# Altium project bailey.PrjPcb (part 10 of 11)
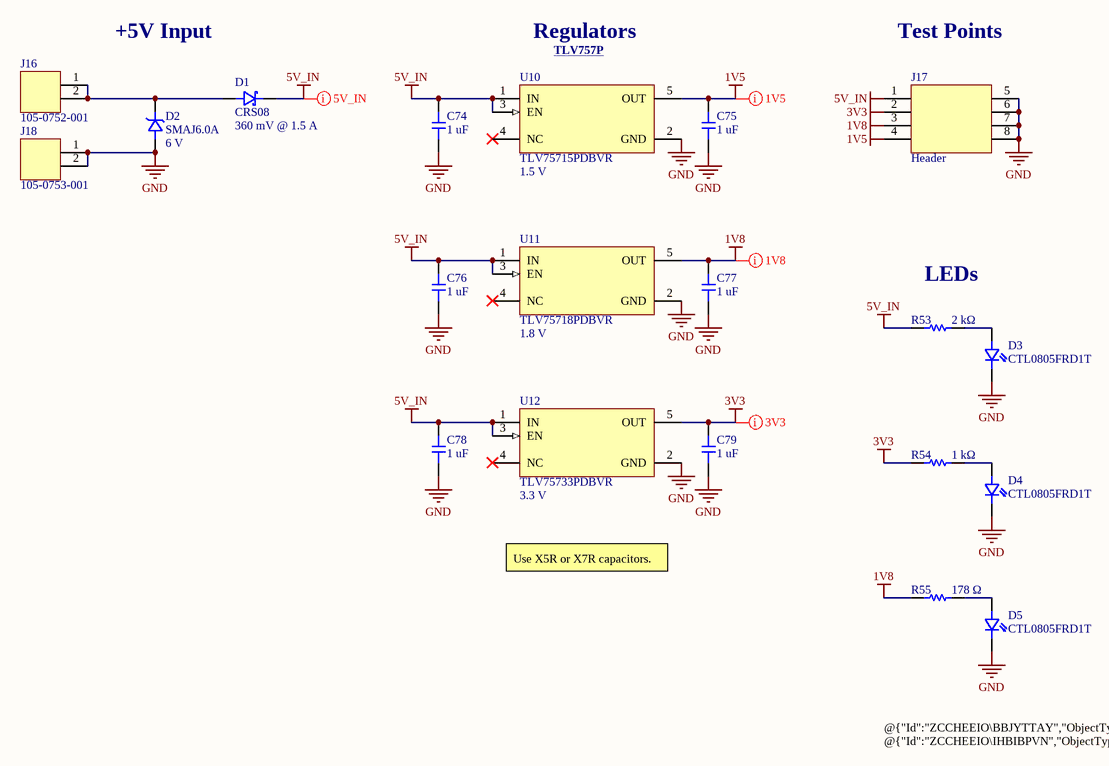
[diagram p14: POWER.SchDoc]

## Sheet POWER.SchDoc (continued)
### Library data of the parts
C74-C79 = CAP: 50V 1uF X7R ±10% 0805 Multilayer Ceramic Capacitors MLCC - SMD/SMT ROHS; Manufacturer: Samsung Electro-Mechanics; Manufacturer Part Number: CL21B105KBFNNNE; Value: 1µF; Tolerance: 10%; Voltage Rating: 50 V; Dielectric: Ceramic; Package Size: 0805; Supplier: DigiKey; Supplier Part Number: 1276-1029-1-ND; RoHS: Compliant; Category: Ceramic Capacitors; Stock: 1783591; Pricing: 1=0.08, 10=0.013 (USD); Case/Package: 0805; Case Code (Imperial): 0805; Case Code (Metric): 2012; China RoHS: Compliant; Country of Origin: Mainland China, Philippines, South Korea; Depth: 1.25mm; Dielectric Material: Ceramic; Export Control Classification Number (ECCN) Code: EAR99; Height: 1.35mm; Harmonized Tariff Schedule (HTS) Code: 8532.24.00.20; Introduction Date: 2010-07-30; Length: 2mm; Lifecycle Status: Production; Material: Ceramic; Max Operating Temperature: 125°C; Min Operating Temperature: -55°C; Mounting Technology: Surface Mount; Number of Terminals: 2; Radiation Hardening: No; REACH SVHC: Yes; Schedule B: 8532240020, 8532240020|8532240020, 8532240020|8532240020|8532240020, 8532240020|8532240020|8532240020|8532240020; Thickness: 1.3462mm; Voltage: 50V; Voltage Rating (DC): 50V; Width: 1.25mm; ComponentLink1URL: https://datasheet.octopart.com:443/CL21B105KBFNNNE-Samsung-Electro-Mechanics-datasheet-136482495.pdf?src-supplier=IHS; ComponentLink1Description: https://datasheet.octopart.com:443/CL21B105KBFNNNE-Samsung-Electro-Mechanics-datasheet-136482495.pdf?src-supplier=IHS; ComponentLink2URL: https://datasheet.octopart.com:443/CL21B105KBFNNNE-Samsung-Electro-Mechanics-datasheet-11733377.pdf?src-supplier=Future+Electronics; ComponentLink2Description: https://datasheet.octopart.com:443/CL21B105KBFNNNE-Samsung-Electro-Mechanics-datasheet-11733377.pdf?src-supplier=Future+Electronics; ComponentLink3URL: https://datasheet.octopart.com:443/CL21B105KBFNNNE-Samsung-Electro-Mechanics-datasheet-116891038.pdf?src-supplier=Future+Electronics; ComponentLink3Description: https://datasheet.octopart.com:443/CL21B105KBFNNNE-Samsung-Electro-Mechanics-datasheet-116891038.pdf?src-supplier=Future+Electronics; ComponentLink4URL: https://datasheet.octopart.com:443/CL21B105KBFNNNE-Samsung-Electro-Mechanics-datasheet-81462183.pdf?src-supplier=Future+Electronics; ComponentLink4Description: https://datasheet.octopart.com:443/CL21B105KBFNNNE-Samsung-Electro-Mechanics-datasheet-81462183.pdf?src-supplier=Future+Electronics; ComponentLink5URL: https://datasheet.octopart.com:443/CL21B105KBFNNNE-Samsung-datasheet-48647582.pdf?src-supplier=Future+Electronics; ComponentLink5Description: https://datasheet.octopart.com:443/CL21B105KBFNNNE-Samsung-datasheet-48647582.pdf?src-supplier=Future+Electronics; ComponentLink6URL: https://datasheet.octopart.com:443/CL21B105KBFNNNE-Samsung-datasheet-8326294.pdf?src-supplier=Future+Electronics; ComponentLink6Description: https://datasheet.octopart.com:443/CL21B105KBFNNNE-Samsung-datasheet-8326294.pdf?src-supplier=Future+Electronics; ComponentLink7URL: https://datasheet.octopart.com:443/CL21B105KBFNNNE-Samsung-Electro-Mechanics-datasheet-149045959.pdf?src-supplier=Future+Electronics; ComponentLink7Description: https://datasheet.octopart.com:443/CL21B105KBFNNNE-Samsung-Electro-Mechanics-datasheet-149045959.pdf?src-supplier=Future+Electronics; ComponentLink8URL: https://datasheet.octopart.com/CL21B105KBFNNNE-Samsung-Electro-Mechanics-datasheet-97040617.pdf; ComponentLink8Description: https://datasheet.octopart.com/CL21B105KBFNNNE-Samsung-Electro-Mechanics-datasheet-97040617.pdf; ComponentLink9URL: https://datasheet.octopart.com/CL21B105KBFNNNE-Samsung-Electro-Mechanics-datasheet-8324245.pdf; ComponentLink9Description: https://datasheet.octopart.com/CL21B105KBFNNNE-Samsung-Electro-Mechanics-datasheet-8324245.pdf; ComponentLink10URL: https://datasheet.octopart.com:443/CL21B105KBFNNNE-Samsung-datasheet-59220082.pdf?src-supplier=TME; ComponentLink10Description: https://datasheet.octopart.com:443/CL21B105KBFNNNE-Samsung-datasheet-59220082.pdf?src-supplier=TME
D1 = CRS08: Rectifier Diode, Schottky, 1 Phase, 1 Element, 1.5A, 30V V(RRM); Manufacturer: Toshiba Semiconductor and Storage; Manufacturer Part Number: CRS08(TE85L,Q,M); Reverse Leakage Current: 1 mA @ 30 V; Value: 90pF; Element Configuration: Single; Max Forward Surge Current (Ifsm): 30A; Max Junction Temperature (Tj): 125°C; Max Reverse Leakage Current: 1mA; Number of Elements: 1; Peak Reverse Current: 50µA; Reverse Voltage: 30 V; Current: 1.5 A; Supplier: DigiKey; Supplier Part Number: CRS08QMCT-ND; RoHS: Compliant; Category: Rectifier Diodes; Stock: 58545; Pricing: 1=0.61, 10=0.374, 100=0.2556, 500=0.19356, 1000=0.17356 (USD); Average Rectified Current: 1.5A; Contact Plating: Silver, Tin; Export Control Classification Number (ECCN) Code: EAR99; Forward Current: 1.5A; Height: 1.08mm; Harmonized Tariff Schedule (HTS) Code: 8541.10.00.80; Introduction Date: 2000-03-07; Lead Free: Lead Free; Lifecycle Status: Production; Max Operating Temperature: 125°C; Max Output current: 1.5A; Max Repetitive Reverse Voltage (Vrrm): 30V; Max Reverse Voltage (DC): 30V; Max Surge Current: 30A; Min Operating Temperature: -40°C; Mounting Technology: Surface Mount; Pins: 2; Packaging: Cut Tape (CT); Peak Non-Repetitive Surge Current: 30A; Radiation Hardening: No; REACH SVHC: No; Reverse Standoff Voltage: 30V; Schedule B: 8541100080, 8541100080|8541100080|8541100080|8541100080|8541100080; ComponentLink1URL: https://datasheet.octopart.com:443/CRS08%28TE85L%2CQ%2CM%29-Toshiba-datasheet-181389526.pdf?src-supplier=IHS; ComponentLink1Description: https://datasheet.octopart.com:443/CRS08%28TE85L%2CQ%2CM%29-Toshiba-datasheet-181389526.pdf?src-supplier=IHS; ComponentLink2URL: https://datasheet.octopart.com:443/CRS08%28TE85L%2CQ%2CM%29-Toshiba-datasheet-11891833.pdf?src-supplier=_legacy+Avnet; ComponentLink2Description: https://datasheet.octopart.com:443/CRS08%28TE85L%2CQ%2CM%29-Toshiba-datasheet-11891833.pdf?src-supplier=_legacy+Avnet; ComponentLink3URL: https://datasheet.octopart.com:443/CRS08%28TE85L%2CQ%2CM%29-Toshiba-datasheet-97785529.pdf?src-supplier=TME; ComponentLink3Description: https://datasheet.octopart.com:443/CRS08%28TE85L%2CQ%2CM%29-Toshiba-datasheet-97785529.pdf?src-supplier=TME; ComponentLink4URL: https://datasheet.octopart.com:443/CRS08%28TE85L%2CQ%2CM%29-Toshiba-datasheet-15948935.pdf?src-supplier=iiiC; ComponentLink4Description: https://datasheet.octopart.com:443/CRS08%28TE85L%2CQ%2CM%29-Toshiba-datasheet-15948935.pdf?src-supplier=iiiC
D2 = SMAJ6.0A: SMAJ Series 10.3 V 0.4 kW Surface Mount Uni-Directional TVS Diode - DO-214AC; Manufacturer: Littelfuse Inc.; Breakdown Voltage: 6.67 V; Maximum Clamping Voltage: 10.3 V; Clamping Voltage: 10.3V; Current: 41A; Direction: Unidirectional; Forward Voltage: 3.5V; Leakage Current: 1µA; Max Breakdown Voltage: 7.37V; Max Junction Temperature (Tj): 150°C; Max Power Dissipation: 3.3W; Max Reverse Leakage Current: 800µA; Max Surge Current: 38.8A; Min Breakdown Voltage: 6.67V; Number of Channels: 1; Operating Supply Voltage: 6V; Peak Pulse Power: 400W; Power Line Protection: No; Reverse Breakdown Voltage: 66.7V; Test Current: 10mA; Voltage: 60V; Manufacturer Part Number: SMAJ6.0A; Supplier: DigiKey; Supplier Part Number: SMAJ6.0ALFCT-ND; RoHS: Compliant; Category: TVS Diodes; Stock: 52074; Pricing: 1=0.16, 10=0.129, 100=0.098, 500=0.097, 1000=0.096, 2000=0.0955, 5000=0.075, 10000=0.06958, 15000=0.05923, 25000=0.05912 (USD); China RoHS: Non-Compliant; Composition: Zener; Country of Origin: Mainland China, Malaysia; Export Control Classification Number (ECCN) Code: EAR99; Height: 2.29mm; Harmonized Tariff Schedule (HTS) Code: 8541.10.00.50; Introduction Date: 2003-11-20; Lead Free: Lead Free; Length: 5.28mm; Lifecycle Status: Production; Max Operating Temperature: 150°C; Min Operating Temperature: -65°C; Mounting Technology: Surface Mount; Number of Elements: 1; Pins: 2; Number of Terminals: 2; Number of Unidirectional Channels: 1; Packaging: Cut Tape; Peak Pulse Current: 38.8A; Peak Reverse Current: 800µA; Polarity: Unidirectional; Power Dissipation: 400W; Power Rating: 400W; Radiation Hardening: No; REACH SVHC: No; Reverse Voltage: 6V; Schedule B: 8541100080, 8541100080|8541100080|8541100080|8541100080|8541100080; Termination: SMD/SMT; Voltage Rating (DC): 6V; Width: 2.79mm; ComponentLink1URL: https://datasheet.octopart.com:443/SMAJ6.0A-Littelfuse-datasheet-150463581.pdf?src-supplier=Newark; ComponentLink1Description: https://datasheet.octopart.com:443/SMAJ6.0A-Littelfuse-datasheet-150463581.pdf?src-supplier=Newark; ComponentLink2URL: https://datasheet.octopart.com:443/SMAJ6.0A-Littelfuse-datasheet-63710798.pdf?src-supplier=element14+APAC; ComponentLink2Description: https://datasheet.octopart.com:443/SMAJ6.0A-Littelfuse-datasheet-63710798.pdf?src-supplier=element14+APAC; ComponentLink3URL: https://datasheet.octopart.com:443/SMAJ6.0A-Littelfuse-datasheet-11547152.pdf?src-supplier=Farnell; ComponentLink3Description: https://datasheet.octopart.com:443/SMAJ6.0A-Littelfuse-datasheet-11547152.pdf?src-supplier=Farnell; ComponentLink4URL: https://datasheet.octopart.com:443/SMAJ6.0A-Littelfuse-datasheet-5393952.pdf?src-supplier=Farnell; ComponentLink4Description: https://datasheet.octopart.com:443/SMAJ6.0A-Littelfuse-datasheet-5393952.pdf?src-supplier=Farnell; ComponentLink5URL: https://datasheet.octopart.com:443/SMAJ6.0A-Littelfuse-datasheet-511791.pdf?src-supplier=Farnell; ComponentLink5Description: https://datasheet.octopart.com:443/SMAJ6.0A-Littelfuse-datasheet-511791.pdf?src-supplier=Farnell; ComponentLink6URL: https://datasheet.octopart.com:443/SMAJ6.0A-Littelfuse-datasheet-165289143.pdf?src-supplier=Electro+Sonic; ComponentLink6Description: https://datasheet.octopart.com:443/SMAJ6.0A-Littelfuse-datasheet-165289143.pdf?src-supplier=Electro+Sonic; ComponentLink7URL: https://datasheet.octopart.com:443/SMAJ6.0A-Littelfuse-datasheet-112042111.pdf?src-supplier=JRH+Electronics; ComponentLink7Description: https://datasheet.octopart.com:443/SMAJ6.0A-Littelfuse-datasheet-112042111.pdf?src-supplier=JRH+Electronics; ComponentLink8URL: https://datasheet.octopart.com:443/SMAJ6.0A-Littelfuse-datasheet-17901671.pdf?src-supplier=Future+Electronics; ComponentLink8Description: https://datasheet.octopart.com:443/SMAJ6.0A-Littelfuse-datasheet-17901671.pdf?src-supplier=Future+Electronics; ComponentLink9URL: https://datasheet.octopart.com:443/SMAJ6.0A-Littelfuse-datasheet-1053.pdf?src-supplier=DigiKey; ComponentLink9Description: https://datasheet.octopart.com:443/SMAJ6.0A-Littelfuse-datasheet-1053.pdf?src-supplier=DigiKey
D3-D5 = CTL0805FRD1T: Chip Type LED, 0805, Flat Lens, Red; Manufacturer: Venkel; Manufacturer Part Number: CTL0805FRD1T-CT; Forward Voltage: 1.5 V; Current: 20 mA; Package Size: 0805
J16 = 105-0752-001: Red Tip Jack Standard Horizontal Pcb Mount For Diameter .080 Plug; Manufacturer: Cinch Connectivity Solutions Johnson; Body Material: Nylon, Polyamide; Breakdown Voltage: 2.1kV; Current Rating: 5A; Gender: Female; Insulation: Mating End Insulated; Number of Contacts: 1; Voltage Rating: 1.5kV; Manufacturer Part Number: 105-0752-001; Supplier: DigiKey; Supplier Part Number: J109-ND; RoHS: Compliant; Category: Connectors; Stock: 9687; Pricing: 1=1.26, 10=1.067, 25=1.0004, 50=0.9526, 100=0.907, 250=0.85016, 500=0.80954, 1000=0.77089, 2500=0.72264 (USD); Color: Red; Contact Material: Silver; Contact Plating: Silver; Depth: 3.96mm; Export Control Classification Number (ECCN) Code: EAR99; Height: 5.4102mm; Housing Color: Red; Housing Material: Nylon; Insulation Material: Nylon; Lead Free: Lead Free; Length: 10.46mm; Lifecycle Status: Production; Max Current Rating: 5A; Max Operating Temperature: 75°C; Min Operating Temperature: -55°C; Mounting Technology: Horizontal, Through Hole, Vertical; Number of Ports: 1; Operating Supply Voltage: 2.1kV; Orientation: Right Angle; Packaging: Bulk; Radiation Hardening: No; REACH SVHC: Yes; Termination: Solder; Voltage Rating (DC): 2.1kV; ComponentLink1URL: https://datasheet.octopart.com:443/105-0752-001-Cinch-Connectors-datasheet-38159067.pdf?src-supplier=element14+APAC; ComponentLink1Description: https://datasheet.octopart.com:443/105-0752-001-Cinch-Connectors-datasheet-38159067.pdf?src-supplier=element14+APAC; ComponentLink2URL: https://datasheet.octopart.com:443/105-0752-001-Cinch-Connectors-datasheet-13703203.pdf?src-supplier=element14+APAC; ComponentLink2Description: https://datasheet.octopart.com:443/105-0752-001-Cinch-Connectors-datasheet-13703203.pdf?src-supplier=element14+APAC; ComponentLink3URL: https://datasheet.octopart.com:443/105-0752-001-Cinch-Connectivity-Solutions-datasheet-128870955.pdf?src-supplier=RS+(Formerly+Allied+Electronics); ComponentLink3Description: https://datasheet.octopart.com:443/105-0752-001-Cinch-Connectivity-Solutions-datasheet-128870955.pdf?src-supplier=RS+(Formerly+Allied+Electronics); ComponentLink4URL: https://datasheet.octopart.com:443/105-0752-001-Cinch-Connectors-datasheet-9995220.pdf?src-supplier=RS+(Formerly+Allied+Electronics); ComponentLink4Description: https://datasheet.octopart.com:443/105-0752-001-Cinch-Connectors-datasheet-9995220.pdf?src-supplier=RS+(Formerly+Allied+Electronics); ComponentLink5URL: https://datasheet.octopart.com:443/105-0752-001-Cinch-Connectivity-Solutions-datasheet-180501155.pdf?src-supplier=IHS; ComponentLink5Description: https://datasheet.octopart.com:443/105-0752-001-Cinch-Connectivity-Solutions-datasheet-180501155.pdf?src-supplier=IHS; ComponentLink6URL: https://datasheet.octopart.com:443/105-0752-001-Cinch-Connectivity-Solutions-datasheet-182240639.pdf?src-supplier=IHS; ComponentLink6Description: https://datasheet.octopart.com:443/105-0752-001-Cinch-Connectivity-Solutions-datasheet-182240639.pdf?src-supplier=IHS; ComponentLink7URL: https://datasheet.octopart.com:443/105-0752-001-Emerson-Network-Power-datasheet-90554.pdf?src-supplier=element14; ComponentLink7Description: https://datasheet.octopart.com:443/105-0752-001-Emerson-Network-Power-datasheet-90554.pdf?src-supplier=element14; ComponentLink8URL: https://datasheet.octopart.com:443/105-0752-001-Emerson-Network-Power-datasheet-10411735.pdf?src-supplier=Farnell; ComponentLink8Description: https://datasheet.octopart.com:443/105-0752-001-Emerson-Network-Power-datasheet-10411735.pdf?src-supplier=Farnell; ComponentLink9URL: https://datasheet.octopart.com:443/105-0752-001-Emerson-Network-Power-datasheet-8828422.pdf?src-supplier=Farnell; ComponentLink9Description: https://datasheet.octopart.com:443/105-0752-001-Emerson-Network-Power-datasheet-8828422.pdf?src-supplier=Farnell; ComponentLink10URL: https://datasheet.octopart.com:443/105-0752-001-Emerson-Network-Power-datasheet-10031126.pdf?src-supplier=Farnell; ComponentLink10Description: https://datasheet.octopart.com:443/105-0752-001-Emerson-Network-Power-datasheet-10031126.pdf?src-supplier=Farnell; ComponentLink11URL: https://datasheet.octopart.com:443/105-0752-001-Emerson-Network-Power-datasheet-47159.pdf?src-supplier=Farnell; ComponentLink11Description: https://datasheet.octopart.com:443/105-0752-001-Emerson-Network-Power-datasheet-47159.pdf?src-supplier=Farnell; ComponentLink12URL: https://datasheet.octopart.com:443/105-0752-001-Emerson-Network-Power-datasheet-40124.pdf?src-supplier=Farnell; ComponentLink12Description: https://datasheet.octopart.com:443/105-0752-001-Emerson-Network-Power-datasheet-40124.pdf?src-supplier=Farnell; ComponentLink13URL: https://datasheet.octopart.com:443/105-0752-001-Emerson-Network-Power-datasheet-29036.pdf?src-supplier=Farnell; ComponentLink13Description: https://datasheet.octopart.com:443/105-0752-001-Emerson-Network-Power-datasheet-29036.pdf?src-supplier=Farnell
J17 = CONN_2x4_2.54mm_PinHeader_Vertical: Pin Header, Board-to-Board, 2.54 mm, 2 Rows, 8 Contacts, Through Hole, TSW Series; Manufacturer: Samtec; Manufacturer Part Number: TSW-104-07-F-D; Manufacturer Lifecycle Status: PRODUCTION; Connector Type: Male Pin; Gender: Male; Max Current Rating: 7.6A; Max Voltage Rating (AC): 550V; Number of Contacts: 8; Pitch: 2.54mm; Supplier: DigiKey; Supplier Part Number: SAM8996-ND; RoHS: Compliant; Category: Headers and Wire Housings; Stock: 18480; Pricing: 1=0.43, 50=0.37, 100=0.31, 500=0.26, 1000=0.22, 2000=0.19, 5000=0.17, 10000=0.15 (USD); Color: Black; Contact Material: Bronze; Contact Mating Length: 5.842mm; Contact Plating: Gold; Depth: 5.08mm; Housing Color: Black; Housing Material: Polyester; Lead Pitch: 2.54mm; Length: 10.16mm; Lifecycle Status: Production; Max Operating Temperature: 125°C; Min Operating Temperature: -55°C; Mounting Technology: Through Hole; Number of Positions: 8; Number of Rows: 2; Orientation: Straight; Radiation Hardening: No; REACH SVHC: No; Row Spacing: 2.54mm; Termination: Solder; ComponentLink1URL: https://datasheet.octopart.com:443/TSW-104-07-F-D-Samtec-datasheet-97325576.pdf?src-supplier=Sager+Electronics; ComponentLink1Description: https://datasheet.octopart.com:443/TSW-104-07-F-D-Samtec-datasheet-97325576.pdf?src-supplier=Sager+Electronics; ComponentLink2URL: https://datasheet.octopart.com:443/TSW-104-07-F-D-Samtec-datasheet-151455181.pdf?src-supplier=Sager+Electronics; ComponentLink2Description: https://datasheet.octopart.com:443/TSW-104-07-F-D-Samtec-datasheet-151455181.pdf?src-supplier=Sager+Electronics; ComponentLink3URL: https://sigma.octopart.com:443/97325577/technical_drawing/Samtec-TSW-104-07-F-D.pdf?src-supplier=HQonline; ComponentLink3Description: https://sigma.octopart.com:443/97325577/technical_drawing/Samtec-TSW-104-07-F-D.pdf?src-supplier=HQonline; ComponentLink4URL: https://datasheet.octopart.com:443/TSW-104-07-F-D-Samtec-datasheet-136646178.pdf?src-supplier=Master+Electronics; ComponentLink4Description: https://datasheet.octopart.com:443/TSW-104-07-F-D-Samtec-datasheet-136646178.pdf?src-supplier=Master+Electronics; ComponentLink5URL: https://datasheet.octopart.com:443/TSW-104-07-F-D-Samtec-datasheet-182948906.pdf?src-supplier=JRH+Electronics; ComponentLink5Description: https://datasheet.octopart.com:443/TSW-104-07-F-D-Samtec-datasheet-182948906.pdf?src-supplier=JRH+Electronics; ComponentLink6URL: https://datasheet.octopart.com:443/TSW-104-07-F-D-Samtec-datasheet-160657603.pdf?src-supplier=Toby+Electronics; ComponentLink6Description: https://datasheet.octopart.com:443/TSW-104-07-F-D-Samtec-datasheet-160657603.pdf?src-supplier=Toby+Electronics; ComponentLink7URL: https://datasheet.octopart.com:443/TSW-104-07-F-D-Samtec-datasheet-116539033.pdf?src-supplier=Toby+Electronics; ComponentLink7Description: https://datasheet.octopart.com:443/TSW-104-07-F-D-Samtec-datasheet-116539033.pdf?src-supplier=Toby+Electronics; ComponentLink8URL: https://datasheet.octopart.com:443/TSW-104-07-F-D-Samtec-datasheet-116536310.pdf?src-supplier=Toby+Electronics; ComponentLink8Description: https://datasheet.octopart.com:443/TSW-104-07-F-D-Samtec-datasheet-116536310.pdf?src-supplier=Toby+Electronics; ComponentLink9URL: https://datasheet.octopart.com:443/TSW-104-07-F-D-Samtec-datasheet-116615235.pdf?src-supplier=Electro+Sonic; ComponentLink9Description: https://datasheet.octopart.com:443/TSW-104-07-F-D-Samtec-datasheet-116615235.pdf?src-supplier=Electro+Sonic; ComponentLink10URL: https://datasheet.octopart.com/TSW-104-07-F-D-Samtec-datasheet-86818365.pdf; ComponentLink10Description: https://datasheet.octopart.com/TSW-104-07-F-D-Samtec-datasheet-86818365.pdf; ComponentLink11URL: https://datasheet.octopart.com:443/TSW-104-07-F-D-Samtec-datasheet-62107121.pdf?src-supplier=Newark; ComponentLink11Description: https://datasheet.octopart.com:443/TSW-104-07-F-D-Samtec-datasheet-62107121.pdf?src-supplier=Newark; ComponentLink12URL: https://datasheet.octopart.com:443/TSW-104-07-F-D-Samtec-datasheet-11047283.pdf?src-supplier=Newark; ComponentLink12Description: https://datasheet.octopart.com:443/TSW-104-07-F-D-Samtec-datasheet-11047283.pdf?src-supplier=Newark
J18 = 105-0753-001: Test Jack, 2mm Diameter Standard Tip Plugs, 5 A, 1.32 mm, 1.5 kV, Black; Manufacturer: Cinch Connectivity Solutions Johnson; Body Material: Nylon, Polyamide; Breakdown Voltage: 2.1kV; Current Rating: 5A; Gender: Female; Insulation: Mating End Insulated; Number of Contacts: 1; Voltage Rating: 1.5kV; Manufacturer Part Number: 105-0753-001; Supplier: DigiKey; Supplier Part Number: J110-ND; RoHS: Compliant; Category: Connectors; Stock: 926; Pricing: 1=1.24, 10=1.057, 25=0.9912, 50=0.9436, 100=0.8985, 250=0.84216, 500=0.80196, 1000=0.76366, 2500=0.71586 (USD); Color: Black; Contact Material: Copper, Silver; Contact Plating: Silver; Country of Origin: USA; Depth: 3.96mm; Diameter: 2mm; Export Control Classification Number (ECCN) Code: EAR99; Height: 5.4102mm; Housing Color: Black; Housing Material: Nylon; Inside Diameter: 2mm; Insulation Material: Nylon; Introduction Date: 1995-01-01; Lead Free: Lead Free; Length: 10.46mm; Lifecycle Status: Production; Max Current Rating: 5A; Max Operating Temperature: 75°C; Min Operating Temperature: -55°C; Mounting Technology: Horizontal, Through Hole, Vertical; Number of Ports: 1; Operating Supply Voltage: 2.1kV; Orientation: Right Angle; Packaging: Bulk; Radiation Hardening: No; REACH SVHC: Yes; Termination: Solder; Voltage Rating (DC): 2.1kV; ComponentLink1URL: https://datasheet.octopart.com:443/105-0753-001-Cinch-Connectors-datasheet-38159068.pdf?src-supplier=element14+APAC; ComponentLink1Description: https://datasheet.octopart.com:443/105-0753-001-Cinch-Connectors-datasheet-38159068.pdf?src-supplier=element14+APAC; ComponentLink2URL: https://datasheet.octopart.com:443/105-0753-001-Cinch-Connectivity-Solutions-datasheet-128870957.pdf?src-supplier=RS+(Formerly+Allied+Electronics); ComponentLink2Description: https://datasheet.octopart.com:443/105-0753-001-Cinch-Connectivity-Solutions-datasheet-128870957.pdf?src-supplier=RS+(Formerly+Allied+Electronics); ComponentLink3URL: https://datasheet.octopart.com:443/105-0753-001-Cinch-Connectors-datasheet-9764224.pdf?src-supplier=RS+(Formerly+Allied+Electronics); ComponentLink3Description: https://datasheet.octopart.com:443/105-0753-001-Cinch-Connectors-datasheet-9764224.pdf?src-supplier=RS+(Formerly+Allied+Electronics); ComponentLink4URL: https://datasheet.octopart.com:443/105-0753-001-Cinch-Connectivity-Solutions-datasheet-180501155.pdf?src-supplier=IHS; ComponentLink4Description: https://datasheet.octopart.com:443/105-0753-001-Cinch-Connectivity-Solutions-datasheet-180501155.pdf?src-supplier=IHS; ComponentLink5URL: https://datasheet.octopart.com:443/105-0753-001-Cinch-Connectivity-Solutions-datasheet-182240639.pdf?src-supplier=IHS; ComponentLink5Description: https://datasheet.octopart.com:443/105-0753-001-Cinch-Connectivity-Solutions-datasheet-182240639.pdf?src-supplier=IHS; ComponentLink6URL: https://datasheet.octopart.com:443/105-0753-001-Cinch-Connectors-datasheet-46969.pdf?src-supplier=Farnell; ComponentLink6Description: https://datasheet.octopart.com:443/105-0753-001-Cinch-Connectors-datasheet-46969.pdf?src-supplier=Farnell; ComponentLink7URL: https://datasheet.octopart.com:443/105-0753-001-Cinch-Connectors-datasheet-13702459.pdf?src-supplier=_legacy+Avnet; ComponentLink7Description: https://datasheet.octopart.com:443/105-0753-001-Cinch-Connectors-datasheet-13702459.pdf?src-supplier=_legacy+Avnet
R53 = RES: 100Mw Thick Film Resistors 100Ppm/ 1% 2K 0603 Chip Resistor Surface Mount Rohs; Manufacturer: Yageo; Manufacturer Part Number: RC0603FR-072KL; Value: 2kΩ; Temperature Coefficient: 100ppm/°C; Voltage Rating: 75V; Voltage Rating (DC): 50V; Tolerance: 1%; Power Rating: *; Package Size: 0603; Supplier: DigiKey; Supplier Part Number: 311-2.00KHRCT-ND; RoHS: Compliant; Category: Chip SMD Resistors; Stock: 1454971; Pricing: 1=0.1, 10=0.007, 25=0.0068, 50=0.0056 (USD); Case/Package: 0603; Case Code (Imperial): 0603; China RoHS: Non-Compliant; Composition: Thick Film; Country of Origin: Mainland China, Taiwan; Depth: 800µm; Export Control Classification Number (ECCN) Code: EAR99; Features: Moisture Resistant; Height: 450µm; Harmonized Tariff Schedule (HTS) Code: 8533.21.00.30; Introduction Date: 2004-10-04; Lead Free: Lead Free; Length: 1.6mm; Lifecycle Status: Production; Max Operating Temperature: 155°C; Max Power Dissipation: 100mW; Military Standard: Not; Min Operating Temperature: -55°C; Mounting Technology: Surface Mount; Pins: 2; Number of Terminals: 2; Number of Terminations: 2; Packaging: Tape & Reel; Power Dissipation: 100mW; REACH SVHC: Yes; Schedule B: 8533210045, 8533210045|8533210045, 8533210045|8533210045|8533210045, 8533210045|8533210045|8533210045|8533210045; Termination: SMD/SMT; Width: 800µm; Working Voltage: 75V; ComponentLink1URL: https://datasheet.octopart.com:443/RC0603FR-072KL-Yageo-datasheet-175887523.pdf?src-supplier=Newark; ComponentLink1Description: https://datasheet.octopart.com:443/RC0603FR-072KL-Yageo-datasheet-175887523.pdf?src-supplier=Newark; ComponentLink2URL: https://datasheet.octopart.com:443/RC0603FR-072KL-Yageo-datasheet-103092701.pdf?src-supplier=Upverter; ComponentLink2Description: https://datasheet.octopart.com:443/RC0603FR-072KL-Yageo-datasheet-103092701.pdf?src-supplier=Upverter; ComponentLink3URL: https://datasheet.octopart.com:443/RC0603FR-072KL-Yageo-datasheet-8328172.pdf?src-supplier=element14+APAC; ComponentLink3Description: https://datasheet.octopart.com:443/RC0603FR-072KL-Yageo-datasheet-8328172.pdf?src-supplier=element14+APAC; ComponentLink4URL: https://datasheet.octopart.com:443/RC0603FR-072KL-Yageo-datasheet-34211833.pdf?src-supplier=element14+APAC; ComponentLink4Description: https://datasheet.octopart.com:443/RC0603FR-072KL-Yageo-datasheet-34211833.pdf?src-supplier=element14+APAC; ComponentLink5URL: https://datasheet.octopart.com:443/RC0603FR-072KL-Yageo-datasheet-62067350.pdf?src-supplier=Farnell; ComponentLink5Description: https://datasheet.octopart.com:443/RC0603FR-072KL-Yageo-datasheet-62067350.pdf?src-supplier=Farnell; ComponentLink6URL: https://datasheet.octopart.com:443/RC0603FR-072KL-Yageo-Group-datasheet-176638170.pdf?src-supplier=Future+Electronics; ComponentLink6Description: https://datasheet.octopart.com:443/RC0603FR-072KL-Yageo-Group-datasheet-176638170.pdf?src-supplier=Future+Electronics; ComponentLink7URL: https://datasheet.octopart.com:443/RC0603FR-072KL-Yageo-datasheet-164759695.pdf?src-supplier=Future+Electronics; ComponentLink7Description: https://datasheet.octopart.com:443/RC0603FR-072KL-Yageo-datasheet-164759695.pdf?src-supplier=Future+Electronics; ComponentLink8URL: https://datasheet.octopart.com:443/RC0603FR-072KL-Yageo-datasheet-137700087.pdf?src-supplier=Future+Electronics; ComponentLink8Description: https://datasheet.octopart.com:443/RC0603FR-072KL-Yageo-datasheet-137700087.pdf?src-supplier=Future+Electronics; ComponentLink9URL: https://datasheet.octopart.com:443/RC0603FR-072KL-Yageo-datasheet-27584510.pdf?src-supplier=Future+Electronics; ComponentLink9Description: https://datasheet.octopart.com:443/RC0603FR-072KL-Yageo-datasheet-27584510.pdf?src-supplier=Future+Electronics; ComponentLink10URL: https://datasheet.octopart.com:443/RC0603FR-072KL-Yageo-datasheet-15599030.pdf?src-supplier=Future+Electronics; ComponentLink10Description: https://datasheet.octopart.com:443/RC0603FR-072KL-Yageo-datasheet-15599030.pdf?src-supplier=Future+Electronics; ComponentLink11URL: https://datasheet.octopart.com:443/RC0603FR-072KL-Yageo-datasheet-12596169.pdf?src-supplier=Future+Electronics; ComponentLink11Description: https://datasheet.octopart.com:443/RC0603FR-072KL-Yageo-datasheet-12596169.pdf?src-supplier=Future+Electronics; ComponentLink12URL: https://datasheet.octopart.com:443/RC0603FR-072KL-Yageo-datasheet-8324193.pdf?src-supplier=Future+Electronics; ComponentLink12Description: https://datasheet.octopart.com:443/RC0603FR-072KL-Yageo-datasheet-8324193.pdf?src-supplier=Future+Electronics; ComponentLink13URL: https://datasheet.octopart.com/RC0603FR-072KL-Yageo-datasheet-73766026.pdf; ComponentLink13Description: https://datasheet.octopart.com/RC0603FR-072KL-Yageo-datasheet-73766026.pdf; ComponentLink14URL: https://datasheet.octopart.com:443/RC0603FR-072KL-Yageo-datasheet-118562.pdf?src-supplier=DigiKey; ComponentLink14Description: https://datasheet.octopart.com:443/RC0603FR-072KL-Yageo-datasheet-118562.pdf?src-supplier=DigiKey; ComponentLink15URL: https://datasheet.octopart.com:443/RC0603FR-072KL-Yageo-datasheet-14181487.pdf?src-supplier=iiiC; ComponentLink15Description: https://datasheet.octopart.com:443/RC0603FR-072KL-Yageo-datasheet-14181487.pdf?src-supplier=iiiC; ComponentLink16URL: http://sigma.octopart.com:80/conflict_mineral_statement/Yageo-company-3.pdf?src-supplier=Compliance+Statements; ComponentLink16Description: http://sigma.octopart.com:80/conflict_mineral_statement/Yageo-company-3.pdf?src-supplier=Compliance+Statements; ComponentLink17URL: http://sigma.octopart.com:80/rohs_statement/Yageo-company-2.pdf?src-supplier=Compliance+Statements; ComponentLink17Description: http://sigma.octopart.com:80/rohs_statement/Yageo-company-2.pdf?src-supplier=Compliance+Statements
R54 = RES: 100mW Thick Film Resistors 75V ±100ppm/℃ ±1% 1kΩ 0603 Chip Resistor - Surface Mount ROHS; Manufacturer: Yageo; Manufacturer Part Number: RC0603FR-071KL; Temperature Coefficient: 100ppm/°C; Voltage Rating: 50V; Tolerance: 1%; Power Rating: *; Package Size: 0603; Supplier: DigiKey; Supplier Part Number: 311-1.00KHRCT-ND; RoHS: Compliant; Category: Chip SMD Resistors; Stock: 5944272; Pricing: 1=0.1, 10=0.008, 25=0.0076, 50=0.0072, 100=0.0061, 250=0.00568, 1000=0.00569, 5000=0.00204 (USD); Case/Package: 0603; Case Code (Imperial): 0603; Case Code (Metric): 0603; China RoHS: Non-Compliant; Composition: Thick Film; Contact Plating: Tin; Country of Origin: Mainland China, Taiwan; Depth: 800µm; Export Control Classification Number (ECCN) Code: EAR99; Height: 450µm; Harmonized Tariff Schedule (HTS) Code: 8533.21.00.30; Introduction Date: 2004-10-04; Lead Free: Lead Free; Length: 1.6mm; Lifecycle Status: Production; Max Operating Temperature: 155°C; Military Standard: Not; Min Operating Temperature: -55°C; Mounting Technology: Surface Mount; Pins: 2; Number of Terminals: 2; Packaging: Tape and Reel; Power Dissipation: 100mW; Radiation Hardening: No; REACH SVHC: Yes; Value: 1kΩ; Schedule B: 8533210045, 8533210045|8533210045|8533210045|8533210045|8533210045|8533210045|8533210045|8533210045|8533210045|8533210045|8533210045|8533210045|8533210045|8533210045|8533210045|8533210045|8533210045|8533210045|8533210045|8533210045|8533210045|8533210045|8533210045|85; Termination: SMD/SMT; Voltage Rating (DC): 50V; Width: 800µm; Working Voltage: 75V; ComponentLink1URL: https://datasheet.octopart.com:443/RC0603FR-071KL-Yageo-datasheet-175887523.pdf?src-supplier=Newark; ComponentLink1Description: https://datasheet.octopart.com:443/RC0603FR-071KL-Yageo-datasheet-175887523.pdf?src-supplier=Newark; ComponentLink2URL: https://datasheet.octopart.com:443/RC0603FR-071KL-Yageo-datasheet-34211833.pdf?src-supplier=Newark; ComponentLink2Description: https://datasheet.octopart.com:443/RC0603FR-071KL-Yageo-datasheet-34211833.pdf?src-supplier=Newark; ComponentLink3URL: https://datasheet.octopart.com:443/RC0603FR-071KL-Yageo-datasheet-12596169.pdf?src-supplier=Newark; ComponentLink3Description: https://datasheet.octopart.com:443/RC0603FR-071KL-Yageo-datasheet-12596169.pdf?src-supplier=Newark; ComponentLink4URL: https://datasheet.octopart.com:443/RC0603FR-071KL-Yageo-datasheet-499455.pdf?src-supplier=Newark; ComponentLink4Description: https://datasheet.octopart.com:443/RC0603FR-071KL-Yageo-datasheet-499455.pdf?src-supplier=Newark; ComponentLink5URL: https://datasheet.octopart.com:443/RC0603FR-071KL-Yageo-datasheet-503470.pdf?src-supplier=Newark; ComponentLink5Description: https://datasheet.octopart.com:443/RC0603FR-071KL-Yageo-datasheet-503470.pdf?src-supplier=Newark; ComponentLink6URL: https://datasheet.octopart.com:443/RC0603FR-071KL-Yageo-datasheet-62067350.pdf?src-supplier=element14+APAC; ComponentLink6Description: https://datasheet.octopart.com:443/RC0603FR-071KL-Yageo-datasheet-62067350.pdf?src-supplier=element14+APAC; ComponentLink7URL: https://datasheet.octopart.com:443/RC0603FR-071KL-Yageo-datasheet-21426514.pdf?src-supplier=element14+APAC; ComponentLink7Description: https://datasheet.octopart.com:443/RC0603FR-071KL-Yageo-datasheet-21426514.pdf?src-supplier=element14+APAC; ComponentLink8URL: https://datasheet.octopart.com:443/RC0603FR-071KL-Yageo-datasheet-141265859.pdf?src-supplier=Upverter; ComponentLink8Description: https://datasheet.octopart.com:443/RC0603FR-071KL-Yageo-datasheet-141265859.pdf?src-supplier=Upverter; ComponentLink9URL: https://datasheet.octopart.com:443/RC0603FR-071KL-Yageo-datasheet-103092701.pdf?src-supplier=Upverter; ComponentLink9Description: https://datasheet.octopart.com:443/RC0603FR-071KL-Yageo-datasheet-103092701.pdf?src-supplier=Upverter; ComponentLink10URL: https://sigma.octopart.com:443/138820526/technical_drawing/Yageo-RC0603FR-071KL.pdf?src-supplier=Upverter; ComponentLink10Description: https://sigma.octopart.com:443/138820526/technical_drawing/Yageo-RC0603FR-071KL.pdf?src-supplier=Upverter; ComponentLink11URL: https://datasheet.octopart.com:443/RC0603FR-071KL-Yageo-datasheet-68297981.pdf?src-supplier=Upverter; ComponentLink11Description: https://datasheet.octopart.com:443/RC0603FR-071KL-Yageo-datasheet-68297981.pdf?src-supplier=Upverter; ComponentLink12URL: https://datasheet.octopart.com:443/RC0603FR-071KL-Yageo-datasheet-8328172.pdf?src-supplier=Farnell; ComponentLink12Description: https://datasheet.octopart.com:443/RC0603FR-071KL-Yageo-datasheet-8328172.pdf?src-supplier=Farnell; ComponentLink13URL: https://datasheet.octopart.com:443/RC0603FR-071KL-Yageo-datasheet-13691069.pdf?src-supplier=Farnell; ComponentLink13Description: https://datasheet.octopart.com:443/RC0603FR-071KL-Yageo-datasheet-13691069.pdf?src-supplier=Farnell; ComponentLink14URL: https://datasheet.octopart.com:443/RC0603FR-071KL-Yageo-datasheet-15599030.pdf?src-supplier=Seeed+Studio; ComponentLink14Description: https://datasheet.octopart.com:443/RC0603FR-071KL-Yageo-datasheet-15599030.pdf?src-supplier=Seeed+Studio; ComponentLink15URL: https://datasheet.octopart.com:443/RC0603FR-071KL-Yageo-Group-datasheet-176638170.pdf?src-supplier=Future+Electronics; ComponentLink15Description: https://datasheet.octopart.com:443/RC0603FR-071KL-Yageo-Group-datasheet-176638170.pdf?src-supplier=Future+Electronics; ComponentLink16URL: https://datasheet.octopart.com:443/RC0603FR-071KL-Yageo-datasheet-164759695.pdf?src-supplier=Future+Electronics; ComponentLink16Description: https://datasheet.octopart.com:443/RC0603FR-071KL-Yageo-datasheet-164759695.pdf?src-supplier=Future+Electronics; ComponentLink17URL: https://datasheet.octopart.com:443/RC0603FR-071KL-Yageo-datasheet-137700087.pdf?src-supplier=Future+Electronics; ComponentLink17Description: https://datasheet.octopart.com:443/RC0603FR-071KL-Yageo-datasheet-137700087.pdf?src-supplier=Future+Electronics; ComponentLink18URL: https://datasheet.octopart.com:443/RC0603FR071KL-Yageo-datasheet-27584510.pdf?src-supplier=Future+Electronics; ComponentLink18Description: https://datasheet.octopart.com:443/RC0603FR071KL-Yageo-datasheet-27584510.pdf?src-supplier=Future+Electronics; ComponentLink19URL: https://datasheet.octopart.com:443/RC0603FR-071KL-Yageo-datasheet-8324193.pdf?src-supplier=Future+Electronics; ComponentLink19Description: https://datasheet.octopart.com:443/RC0603FR-071KL-Yageo-datasheet-8324193.pdf?src-supplier=Future+Electronics; ComponentLink20URL: https://datasheet.octopart.com:443/RC0603FR-071KL-Yageo-datasheet-79472498.pdf?src-supplier=Megastar; ComponentLink20Description: https://datasheet.octopart.com:443/RC0603FR-071KL-Yageo-datasheet-79472498.pdf?src-supplier=Megastar; ComponentLink21URL: https://datasheet.octopart.com/RC0603FR-071KL-Yageo-datasheet-73766026.pdf; ComponentLink21Description: https://datasheet.octopart.com/RC0603FR-071KL-Yageo-datasheet-73766026.pdf; ComponentLink22URL: https://datasheet.octopart.com:443/RC0603FR-071KL-Yageo-datasheet-118562.pdf?src-supplier=DigiKey; ComponentLink22Description: https://datasheet.octopart.com:443/RC0603FR-071KL-Yageo-datasheet-118562.pdf?src-supplier=DigiKey; ComponentLink23URL: http://sigma.octopart.com:80/conflict_mineral_statement/Yageo-company-3.pdf?src-supplier=Compliance+Statements; ComponentLink23Description: http://sigma.octopart.com:80/conflict_mineral_statement/Yageo-company-3.pdf?src-supplier=Compliance+Statements; ComponentLink24URL: http://sigma.octopart.com:80/rohs_statement/Yageo-company-2.pdf?src-supplier=Compliance+Statements; ComponentLink24Description: http://sigma.octopart.com:80/rohs_statement/Yageo-company-2.pdf?src-supplier=Compliance+Statements
R55 = RES: Res Thick Film 0603 178 Ohm 1% 0.1W(1/10W) ±100ppm/C Pad SMD T/R; Manufacturer: Yageo; Manufacturer Part Number: RC0603FR-07178RL; Power Dissipation: 100mW; Value: 178Ω; Temperature Coefficient: 100ppm/°C; Voltage Rating: 75V; Voltage Rating (DC): 50V; Tolerance: 1%; Power Rating: *; Package Size: 0603; Supplier: DigiKey; Supplier Part Number: 311-178HRCT-ND; RoHS: Compliant; Category: Chip SMD Resistors; Stock: 269039; Pricing: 1=0.1, 10=0.006, 25=0.0056, 50=0.0052 (USD); Case/Package: 0603; Case Code (Imperial): 0603; China RoHS: Non-Compliant; Composition: Thick Film; Depth: 800µm; Height: 450µm; Lead Free: Lead Free; Length: 1.6mm; Lifecycle Status: Production; Max Operating Temperature: 155°C; Military Standard: Not; Min Operating Temperature: -55°C; Mounting Technology: Surface Mount; Number of Terminals: 2; Packaging: Tape & Reel; REACH SVHC: Yes; Schedule B: 8533210045, 8533210045|8533210045|8533210045|8533210045|8533210045; Termination: SMD/SMT; Width: 800µm; Working Voltage: 75V; ComponentLink1URL: https://datasheet.octopart.com:443/RC0603FR-07178RL-Yageo-datasheet-175887523.pdf?src-supplier=Newark; ComponentLink1Description: https://datasheet.octopart.com:443/RC0603FR-07178RL-Yageo-datasheet-175887523.pdf?src-supplier=Newark; ComponentLink2URL: https://datasheet.octopart.com:443/RC0603FR-07178RL-Yageo-datasheet-103092701.pdf?src-supplier=Upverter; ComponentLink2Description: https://datasheet.octopart.com:443/RC0603FR-07178RL-Yageo-datasheet-103092701.pdf?src-supplier=Upverter; ComponentLink3URL: https://datasheet.octopart.com:443/RC0603FR-07178RL-Yageo-Group-datasheet-176638170.pdf?src-supplier=Future+Electronics; ComponentLink3Description: https://datasheet.octopart.com:443/RC0603FR-07178RL-Yageo-Group-datasheet-176638170.pdf?src-supplier=Future+Electronics; ComponentLink4URL: https://datasheet.octopart.com:443/RC0603FR-07178RL-Yageo-datasheet-164759695.pdf?src-supplier=Future+Electronics; ComponentLink4Description: https://datasheet.octopart.com:443/RC0603FR-07178RL-Yageo-datasheet-164759695.pdf?src-supplier=Future+Electronics; ComponentLink5URL: https://datasheet.octopart.com:443/RC0603FR-07178RL-Yageo-datasheet-137700087.pdf?src-supplier=Future+Electronics; ComponentLink5Description: https://datasheet.octopart.com:443/RC0603FR-07178RL-Yageo-datasheet-137700087.pdf?src-supplier=Future+Electronics; ComponentLink6URL: https://datasheet.octopart.com:443/RC0603FR-07178RL-Yageo-datasheet-101672632.pdf?src-supplier=Future+Electronics; ComponentLink6Description: https://datasheet.octopart.com:443/RC0603FR-07178RL-Yageo-datasheet-101672632.pdf?src-supplier=Future+Electronics; ComponentLink7URL: https://datasheet.octopart.com:443/RC0603FR-07178RL-Yageo-datasheet-15599030.pdf?src-supplier=Future+Electronics; ComponentLink7Description: https://datasheet.octopart.com:443/RC0603FR-07178RL-Yageo-datasheet-15599030.pdf?src-supplier=Future+Electronics; ComponentLink8URL: https://datasheet.octopart.com:443/RC0603FR-07178RL-Yageo-datasheet-12596169.pdf?src-supplier=Future+Electronics; ComponentLink8Description: https://datasheet.octopart.com:443/RC0603FR-07178RL-Yageo-datasheet-12596169.pdf?src-supplier=Future+Electronics; ComponentLink9URL: https://datasheet.octopart.com:443/RC0603FR-07178RL-Yageo-datasheet-8328172.pdf?src-supplier=Future+Electronics; ComponentLink9Description: https://datasheet.octopart.com:443/RC0603FR-07178RL-Yageo-datasheet-8328172.pdf?src-supplier=Future+Electronics; ComponentLink10URL: https://datasheet.octopart.com:443/RC0603FR-07178RL-Yageo-datasheet-148775077.pdf?src-supplier=TME; ComponentLink10Description: https://datasheet.octopart.com:443/RC0603FR-07178RL-Yageo-datasheet-148775077.pdf?src-supplier=TME; ComponentLink11URL: https://datasheet.octopart.com/RC0603FR-07178RL-Yageo-datasheet-73766026.pdf; ComponentLink11Description: https://datasheet.octopart.com/RC0603FR-07178RL-Yageo-datasheet-73766026.pdf; ComponentLink12URL: https://datasheet.octopart.com:443/RC0603FR-07178RL-Yageo-datasheet-118562.pdf?src-supplier=DigiKey; ComponentLink12Description: https://datasheet.octopart.com:443/RC0603FR-07178RL-Yageo-datasheet-118562.pdf?src-supplier=DigiKey; ComponentLink13URL: http://sigma.octopart.com:80/conflict_mineral_statement/Yageo-company-3.pdf?src-supplier=Compliance+Statements; ComponentLink13Description: http://sigma.octopart.com:80/conflict_mineral_statement/Yageo-company-3.pdf?src-supplier=Compliance+Statements; ComponentLink14URL: http://sigma.octopart.com:80/rohs_statement/Yageo-company-2.pdf?src-supplier=Compliance+Statements; ComponentLink14Description: http://sigma.octopart.com:80/rohs_statement/Yageo-company-2.pdf?src-supplier=Compliance+Statements
U10 = TLV75715PDBVR: 1-A, low-IQ high-accuracy low-dropout (LDO) voltage regulator with enable 5-SOT-23 -40 to 125; Manufacturer: Texas Instruments; Manufacturer Lifecycle Status: ACTIVE; Output Current: 1 A; Number of Channels: 1; Manufacturer Part Number: TLV75715PDBVR; Supplier: DigiKey; Supplier Part Number: 296-51811-1-ND; RoHS: Compliant; Category: LDO Voltage Regulators; Stock: 5294; Pricing: 1=0.33, 10=0.229, 25=0.2032, 100=0.1751, 250=0.16168, 500=0.15358, 1000=0.14692 (USD); Case/Package: SOT-23; Height: 1.45mm; Length: 2.9mm; Lifecycle Status: Production; Pins: 5; Schedule B: 8542390000, 8542390000|8542390000|8542390000|8542390000|8542390000; Thickness: 1.2mm; Width: 1.6mm; ComponentLink1URL: https://sigma.octopart.com:443/177332311/technical_drawing/Texas-Instruments-TLV75715PDBVR.pdf?src-supplier=Texas+Instruments; ComponentLink1Description: https://sigma.octopart.com:443/177332311/technical_drawing/Texas-Instruments-TLV75715PDBVR.pdf?src-supplier=Texas+Instruments; ComponentLink2URL: https://octopart.com:443/opatz8j6/c1?t=d7hvVLm4alBnrD3gkoHfRsgVc1UpAt6tbgzimL6eSJHfNPIcKrEVXQLPrKOO7wEDCX4HSMm6lfhF85OQD0xZdGvf6YWAiJrNuU8QSKvAnaGmkYyNKOgtKPgJdm2OaEBsByZGVv6T58nARThbWe1wCDIr6BKAyHSOruR31SjFlLsIzO3eYwhk2SNazcjQEifyacoOczK47_MXfEqqNpMaSiFFoskCbrfDKYLBx_wVUhWKdX9fsUXPW-zYIgEWS08DbpwwKwl3pwwBgOyAlAA6_Yry7nSOOwYgpeH3zDS82lMdNd1MWU3-D1w86_UIiW06pjzBAlAruU2xcUUpgVxcbRgleA5mpoOQkUHtNLHgmtjr9P-5BMHIlnvvtbjHE33fVSndxig&src-supplier=Texas+Instruments; ComponentLink2Description: https://octopart.com:443/opatz8j6/c1?t=d7hvVLm4alBnrD3gkoHfRsgVc1UpAt6tbgzimL6eSJHfNPIcKrEVXQLPrKOO7wEDCX4HSMm6lfhF85OQD0xZdGvf6YWAiJrNuU8QSKvAnaGmkYyNKOgtKPgJdm2OaEBsByZGVv6T58nARThbWe1wCDIr6BKAyHSOruR31SjFlLsIzO3eYwhk2SNazcjQEifyacoOczK47_MXfEqqNpMaSiFFoskCbrfDKYLBx_wVUhWKdX9fsUXPW-zYIgEWS08DbpwwKwl3pwwBgOyAlAA6_Yry7nSOOwYgpeH3zDS82lMdNd1MWU3-D1w86_UIiW06pjzBAlAruU2xcUUpgVxcbRgleA5mpoOQkUHtNLHgmtjr9P-5BMHIlnvvtbjHE33fVSndxig&src-supplier=Texas+Instruments; ComponentLink3URL: https://sigma.octopart.com:443/175570406/technical_drawing/Texas-Instruments-TLV75715PDBVR.pdf?src-supplier=Texas+Instruments; ComponentLink3Description: https://sigma.octopart.com:443/175570406/technical_drawing/Texas-Instruments-TLV75715PDBVR.pdf?src-supplier=Texas+Instruments; ComponentLink4URL: https://sigma.octopart.com:443/169406034/technical_drawing/Texas-Instruments-TLV75715PDBVR.pdf?src-supplier=Texas+Instruments; ComponentLink4Description: https://sigma.octopart.com:443/169406034/technical_drawing/Texas-Instruments-TLV75715PDBVR.pdf?src-supplier=Texas+Instruments; ComponentLink5URL: https://sigma.octopart.com:443/155939316/technical_drawing/Texas-Instruments-TLV75715PDBVR.pdf?src-supplier=Texas+Instruments; ComponentLink5Description: https://sigma.octopart.com:443/155939316/technical_drawing/Texas-Instruments-TLV75715PDBVR.pdf?src-supplier=Texas+Instruments; ComponentLink6URL: https://sigma.octopart.com:443/102331370/technical_drawing/Texas-Instruments-TLV75715PDBVR.pdf?src-supplier=Texas+Instruments; ComponentLink6Description: https://sigma.octopart.com:443/102331370/technical_drawing/Texas-Instruments-TLV75715PDBVR.pdf?src-supplier=Texas+Instruments; ComponentLink7URL: https://datasheet.octopart.com:443/TLV75715PDBVR-Texas-Instruments-datasheet-164419132.pdf?src-supplier=Augswan; ComponentLink7Description: https://datasheet.octopart.com:443/TLV75715PDBVR-Texas-Instruments-datasheet-164419132.pdf?src-supplier=Augswan; ComponentLink8URL: http://sigma.octopart.com:80/reach_statement/Texas-Instruments-company-64.pdf?src-supplier=Compliance+Statements; ComponentLink8Description: http://sigma.octopart.com:80/reach_statement/Texas-Instruments-company-64.pdf?src-supplier=Compliance+Statements; ComponentLink9URL: http://sigma.octopart.com:80/conflict_mineral_statement/Texas-Instruments-company-63.pdf?src-supplier=Compliance+Statements; ComponentLink9Description: http://sigma.octopart.com:80/conflict_mineral_statement/Texas-Instruments-company-63.pdf?src-supplier=Compliance+Statements